# Altium project NASCO Alarm Interface.PrjPcb
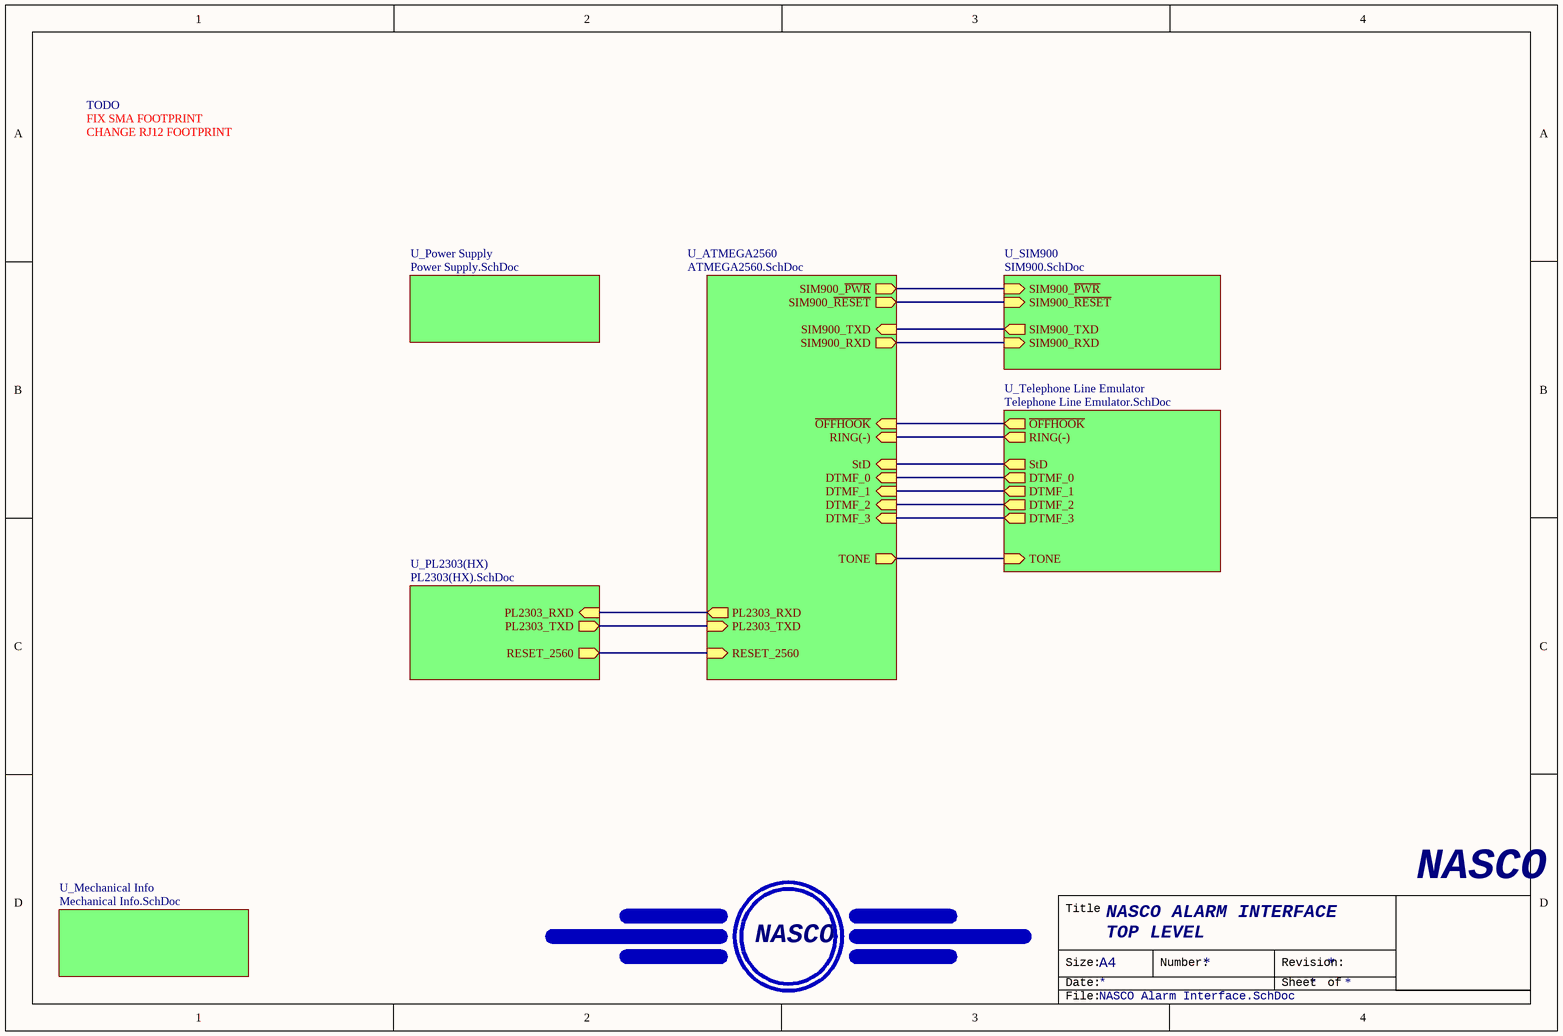
[diagram p0: NASCO Alarm Interface.SchDoc]
7 sheets, 123 parts. Net scope: hierarchical (ports join the sheet entries above them; power ports are global).
Board files: Seeed Case (113x70x25) - Alarm Interface End PLate 01.PcbDoc, Seeed Case (113x70x25) - Alarm Interface (2560).PcbDoc, Seeed Case (113x70x25) - Alarm Interface End PLate 02.PcbDoc, SEEED ORDER ALARM INTERFACE 100mm x 150mm.PcbDoc
Sheets:
  NASCO Alarm Interface.SchDoc
    U_Power Supply = Power Supply.SchDoc
    U_SIM900 = SIM900.SchDoc
    U_Mechanical Info = Mechanical Info.SchDoc
    U_Telephone Line Emulator = Telephone Line Emulator.SchDoc
    U_PL2303(HX) = PL2303(HX).SchDoc
    U_ATMEGA2560 = ATMEGA2560.SchDoc

## Sheet NASCO Alarm Interface.SchDoc: NASCO ALARM INTERFACE
size A4; Title2: TOP LEVEL

### Parts
(Parts that share a designator on the sheet are numbered #1, #2 ... from top to bottom, then left to right.)
?#1  (no value)  (no BOM)
LOGO1  NASCO  [NASCO_LOGO]  (value not drawn)  (no BOM)

### Sub-sheets
U_ATMEGA2560 = ATMEGA2560.SchDoc: DTMF_1 (in), ~{OFFHOOK} (in), DTMF_2 (in), DTMF_0 (in), SIM900_~{RESET} (out), SIM900_~{PWR} (out), TONE (out), SIM900_TXD (in), SIM900_RXD (out), StD (in), DTMF_3 (in), PL2303_RXD (out), PL2303_TXD (in), RESET_2560 (in), RING(-) (in)
U_Mechanical Info = Mechanical Info.SchDoc: no entries
U_PL2303(HX) = PL2303(HX).SchDoc: PL2303_TXD (out), PL2303_RXD (in), RESET_2560 (out)
U_Power Supply = Power Supply.SchDoc: no entries
U_SIM900 = SIM900.SchDoc: SIM900_~{PWR} (in), SIM900_~{RESET} (in), SIM900_RXD (in), SIM900_TXD (out)
U_Telephone Line Emulator = Telephone Line Emulator.SchDoc: ~{OFFHOOK} (out), StD (out), DTMF_0 (out), DTMF_1 (out), DTMF_2 (out), DTMF_3 (out), TONE (in), RING(-) (out)

### Nets
DTMF_0: sheet U_Telephone Line Emulator/DTMF_0, sheet U_ATMEGA2560/DTMF_0
DTMF_1: sheet U_Telephone Line Emulator/DTMF_1, sheet U_ATMEGA2560/DTMF_1
DTMF_2: sheet U_Telephone Line Emulator/DTMF_2, sheet U_ATMEGA2560/DTMF_2
DTMF_3: sheet U_Telephone Line Emulator/DTMF_3, sheet U_ATMEGA2560/DTMF_3
PL2303_RXD: sheet U_PL2303(HX)/PL2303_RXD, sheet U_ATMEGA2560/PL2303_RXD
PL2303_TXD: sheet U_PL2303(HX)/PL2303_TXD, sheet U_ATMEGA2560/PL2303_TXD
RING(-): sheet U_Telephone Line Emulator/RING(-), sheet U_ATMEGA2560/RING(-)
SIM900_~{PWR}: sheet U_SIM900/SIM900_~{PWR}, sheet U_ATMEGA2560/SIM900_~{PWR}
SIM900_~{RESET}: sheet U_SIM900/SIM900_~{RESET}, sheet U_ATMEGA2560/SIM900_~{RESET}
SIM900_RXD: sheet U_SIM900/SIM900_RXD, sheet U_ATMEGA2560/SIM900_RXD
SIM900_TXD: sheet U_SIM900/SIM900_TXD, sheet U_ATMEGA2560/SIM900_TXD
StD: sheet U_Telephone Line Emulator/StD, sheet U_ATMEGA2560/StD
TONE: sheet U_Telephone Line Emulator/TONE, sheet U_ATMEGA2560/TONE
NetC28_1: sheet U_PL2303(HX)/RESET_2560, sheet U_ATMEGA2560/RESET_2560
(unnamed): sheet U_Telephone Line Emulator/~{OFFHOOK}, sheet U_ATMEGA2560/~{OFFHOOK}

### Notes on the sheet
- TODO
- FIX SMA FOOTPRINT
- CHANGE RJ12 FOOTPRINT
- Title
- NASCO
- Size:
- Date:
- A4
- Number:
- Revision:
- Sheet
- of
- File:

### Library data of the parts
?#1 = NASCO_LOGO: LOGO
LOGO1 = NASCO_LOGO: Quad 2-Input OR Gate

## Sheet Power Supply.SchDoc: Power Supply
size A4; Title2: NASCO ALARM INTERFACE
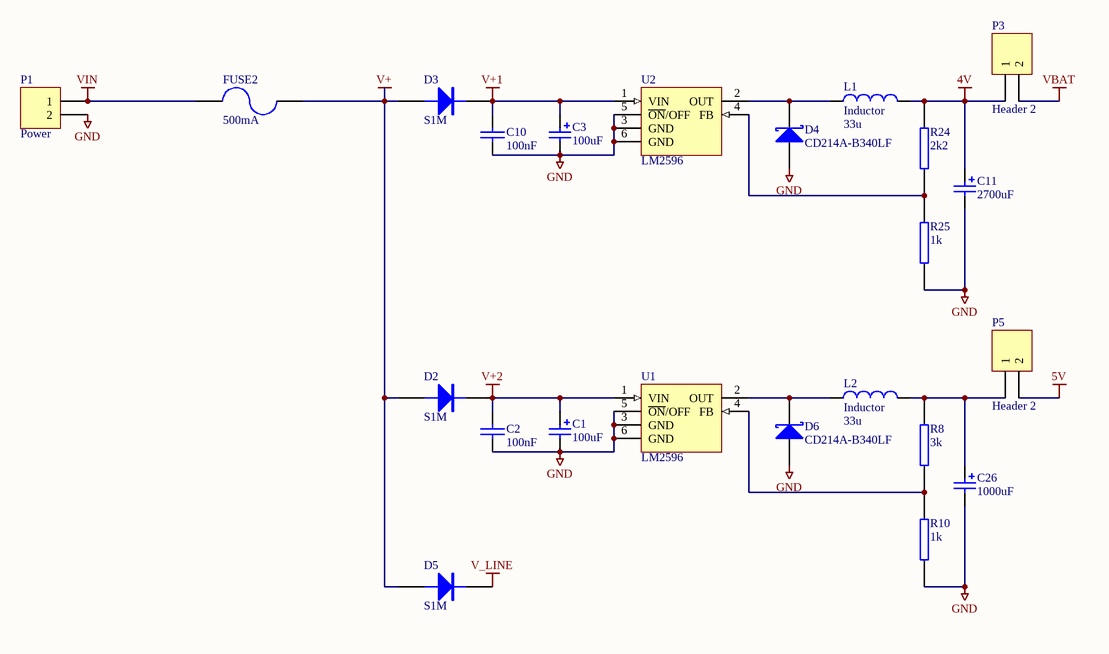
[diagram p1: Power Supply.SchDoc]

### Parts
(Parts that share a designator on the sheet are numbered #1, #2 ... from top to bottom, then left to right.)
?#2  (no value)  (no BOM)
C1  100uF  [CAP ELECTRO SIZE-E]
C2  100nF  [CAP (3D) - 0603]
C3  100uF  [CAP ELECTRO SIZE-E]
C10  100nF  [CAP (3D) - 0603]
C11  2700uF  [CAP D(16) L(20) P(7.5)]
C26  1000uF  [CAP ELECTRO SIZE-G]
D2  S1M  [DO-214AC]
D3  S1M  [DO-214AC]
D4  CD214A-B340LF  [DO-214AC]
D5  S1M  [DO-214AC]
D6  CD214A-B340LF  [DO-214AC]
FUSE2  500mA  [miniSMD Polyswitch]
L1  Inductor  value 33u  [INDUCTOR 12x12x8]
L2  Inductor  value 33u  [INDUCTOR 12x12x8]
P1  Power  [5.08mm HEADER 2 Way RA- With Socket]
P3  Header 2  [HDR1X2]
P5  Header 2  [HDR1X2]
R8  3k  [RES (3D) - 0603]
R10  1k  [RES (3D) - 0603]
R24  2k2  [RES (3D) - 0603]
R25  1k  [RES (3D) - 0603]
U1  LM2596  [D2-PAK]
U2  LM2596  [D2-PAK]

### Nets
4V: C11.1 L1.2 P3.1 R24.2
5V: P5.2
GND: C1.2 C2.2 C3.2 C10.2 C11.2 C26.2 D4.1(A) D6.1(A) P1.2 R10.1 R25.1 U1.3(GND) U1.5(~{ON}/OFF) U1.6(GND) U2.3(GND) U2.5(~{ON}/OFF) U2.6(GND)
V+: D2.1(A) D3.1(A) D5.1(A) FUSE2.2
V+1: C3.1 C10.1 D3.2(K) U2.1(VIN)
V+2: C1.1 C2.1 D2.2(K) U1.1(VIN)
V_LINE: D5.2(K)
VBAT: P3.2
VIN: FUSE2.1 P1.1
NetC26_1: C26.1 L2.2 P5.1 R8.2
NetD4_2: D4.2(K) L1.1 U2.2(OUT)
NetD6_2: D6.2(K) L2.1 U1.2(OUT)
NetR8_1: R8.1 R10.2 U1.4(FB)
NetR24_1: R24.1 R25.2 U2.4(FB)

### Notes on the sheet
- Title
- NASCO
- Size:
- Date:
- A4
- Number:
- Revision:
- Sheet
- of
- File:

### Library data of the parts
?#2 = NASCO_LOGO: LOGO
C1 C3 = 100uF 25V ALU E: 100uF 25V; Manufacturer: Cornell Dubilier; Manufacturer Part No.: AVE107M25E16T-F; Mouser Part no.: 598-AVE107M25E16T-F; Web link: http://au.mouser.com/ProductDetail/Cornell-Dubilier/AVE107M25E16T-F/?qs=%2fha2pyFaduhQkIFxhTUYGHjqKtvzDu12YwE1LyhVKKrxkq5U81i5PA%3d%3d; value: 100uF
C2 C10 = CAP: CAPACITOR SMD 0603; Manufacturer: Murata; Manufacturer Part No.: GRM155R61C104KA88D; value: 100nF; Mouser Part no.: 81-GRM155R61C104KA8D; Web link: http://au.mouser.com/ProductDetail/Murata/GRM155R61C104KA88D/?qs=sGAEpiMZZMvQvaS66kI3TkNFPW5pBWErgqKrdkfeYZ0%3d
C11 = 1000uF 10V ALU G_1: 1000uF 10V; Manufacturer: United Chemi-Con; Manufacturer Part No.: EKY160ELL272ML2; Mouser Part no.: 661-EKY160ELL272ML2; Web link: http://au.mouser.com/ProductDetail/United-Chemi-Con/EKY-160ELL272ML20S/?qs=sGAEpiMZZMvwFf0viD3Y3bQZ8h8ImlHo9v7yx13%2fr4k%3d; value: 2700uF
C26 = 1000uF 10V ALU G_1: 1000uF 10V; Manufacturer: Cornell Dubilier; Manufacturer Part No.: AVE108M10G24T-F; Mouser Part no.: 598-AVE108M10G24T-F; Web link: http://au.mouser.com/ProductDetail/Cornell-Dubilier/AVE108M10G24T-F/?qs=%2fha2pyFadug75LpTQjHjNGQwsAAww7cyi%2fKrS3OU0d%252beOC8957EMoA%3d%3d; value: 1000uF
D2 D3 D5 = DIODE: DIODE, POWER; Manufacturer: TAIWAN SEMI; Mouser Part no.: 821-S1M; Manufacturer Part No.: S1M; value: S1M; Web link: http://au.mouser.com/ProductDetail/Taiwan-Semiconductor/S1M/?qs=sGAEpiMZZMtEwUVCuofpuOlSmRjzJonf%252bmrIm0%252bGbjE%3d
D4 D6 = CD214A-B340LF: CD214A-B340LF 3A SCHOTTKY (40V RB); Manufacturer: Bourns; Value: CD214A-B340LF; Mouser Part No.: 652-CD214A-B340L; Manufacturer Part No.: CD214A-B340LF; Web link: http://au.mouser.com/ProductDetail/Bourns/CD214A-B340LF/?qs=sGAEpiMZZMtQ8nqTKtFS%2fKwbXeWFhcmVvJlIIUC0L%252bY%3d
FUSE2 = POLYSWITCH 500mA: Manufacturer: Tyco Electronics / Raychem; Manufacturer Part No.: MINISMDC050F-2; Mouser Part no.: 650-MINISMDC050F-2; Web link: http://au.mouser.com/ProductDetail/Tyco-Electronics-Raychem/MINISMDC050F-2/?qs=sGAEpiMZZMu7EFbsM1w0neRfX3mrvYIvOpkrchiUGng%3d
L1 L2 = Inductor: Manufacturer: Wurth Electronics; Manufacturer Part No.: 744771133; Mouser Part no.: 710-744771133; Web link: http://au.mouser.com/ProductDetail/Wurth-Electronics/744771133/?qs=sGAEpiMZZMsg%252by3WlYCkU2ZZAkgqljbFFwrzfiyMF9Y%3d
P1 = Header 2H: Header, 2-Pin, Right Angle; Manufacturer: Phoenix Contact; Manufacturer Part No.: 1759017; value: 1759017; Mouser Part no.: 651-1759017; Web link: http://au.mouser.com/ProductDetail/Phoenix-Contact/1759017/?qs=%2fha2pyFaduimeVQ2k4UhN6tA4bHm0b5wnhHOccU1U80%3d
P3 P5 = Header 2: Header, 2-Pin; value: 0.100" HEADER
R8 R24 = RES SMD 0603 10k: RESISTOR SMD 0603; Manufacturer: Panasonic; Manufacturer Part No.: ERJ-3GEYJ302V; Mouser Part no.: 667-ERJ-3GEYJ302V; Web link: http://au.mouser.com/ProductDetail/Panasonic/ERJ-3GEYJ302V/?qs=sGAEpiMZZMtlubZbdhIBINbsJb0hdM3zru2opQIvmPo%3d
  R8: value: 3k
  R24: value: 2k2
R10 R25 = RES SMD 0603 10k: RESISTOR SMD 0603; Manufacturer: Bourns; Manufacturer Part No.: CR0603-JW-102ELF; Mouser Part no.: 652-CR0603-JW-102ELF; Web link: http://au.mouser.com/ProductDetail/Bourns/CR0603-JW-102ELF/?qs=sGAEpiMZZMu61qfTUdNhG2nPoCjtvs%252bRXTOJv8O9Kbk%3d; value: 1k
U1 U2 = LM2576D2T-ADJ: Easy Switcher 3.0A Step-Down Voltage Regulator; Manufacturer: ON Semiconductor; Manufacturer Part No.: LM2596DSADJR4G; Mouser Part no.: 863-LM2596DSADJR4G; Web link: http://au.mouser.com/ProductDetail/ON-Semiconductor/LM2596DSADJR4G/?qs=sGAEpiMZZMtitjHzVIkrqajYz32%2fGPtlajdv3bHlruk%3d; value: LM2596

## Sheet SIM900.SchDoc: SIM900
size A4; Title2: NASCO ALARM INTERFACE
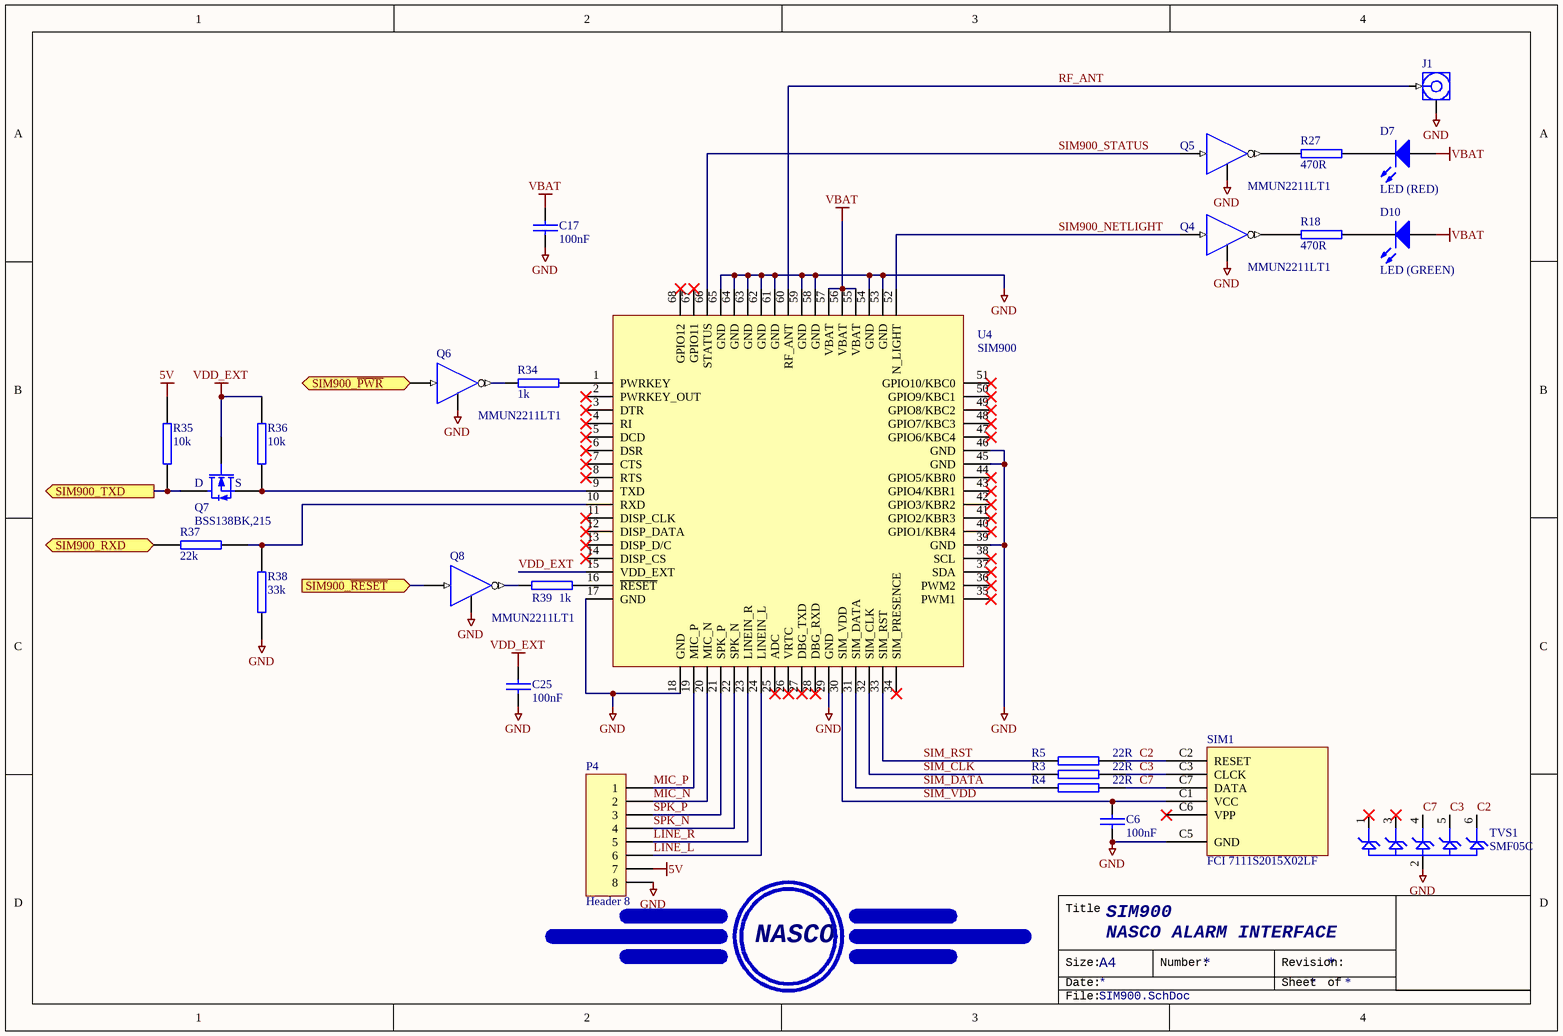
[diagram p2: SIM900.SchDoc]

### Parts
(Parts that share a designator on the sheet are numbered #1, #2 ... from top to bottom, then left to right.)
?#3  (no value)  (no BOM)
C6  100nF  [CAP (3D) - 0603]
C17  100nF  [CAP (3D) - 0603]
C25  100nF  [CAP (3D) - 0603]
D7  LED (RED)  [LED(3D) 3MM RIGHT ANGLE RED]
D10  LED (GREEN)  [LED(3D) 3MM RIGHT ANGLE GREEN]
J1  SMA  [SMA EDGE MOUNT]  (value not drawn)
P4  Header 8  [HDR1X8 (3D)]  (no BOM)
Q4  MMUN2211LT1  [SOT23-3L]
Q5  MMUN2211LT1  [SOT23-3L]
Q6  MMUN2211LT1  [SOT23-3L]
Q7  BSS138BK,215  [SOT23-3L]
Q8  MMUN2211LT1  [SOT23-3L]
R3  22R  [RES (3D) - 0603]
R4  22R  [RES (3D) - 0603]
R5  22R  [RES (3D) - 0603]
R18  470R  [RES (3D) - 0603]
R27  470R  [RES (3D) - 0603]
R34  1k  [RES (3D) - 0603]
R35  10k  [RES (3D) - 0603]
R36  10k  [RES (3D) - 0603]
R37  22k  [RES (3D) - 0603]
R38  33k  [RES (3D) - 0603]
R39  1k  [RES (3D) - 0603]
SIM1  FCI 7111S2015X02LF  [SIM CARD]
TVS1  SMF05C  [SOT-363]
U4  SIM900  [SIM900]

### Ports
SIM900_RXD (in), SIM900_TXD (out), SIM900_~{PWR} (in), SIM900_~{RESET} (in)

### Nets
5V: P4.7 R35.2
GND: C6.2 C17.2 C25.2 J1.2(GND) P4.8 Q4.2(E) Q5.2(E) Q6.2(E) Q8.2(E) R38.2 SIM1.C5(GND) TVS1.2(A) U4.17(GND) U4.18(GND) U4.29(GND) U4.39(GND) U4.45(GND) U4.46(GND) U4.53(GND) U4.54(GND) U4.58(GND) U4.59(GND) U4.61(GND) U4.62(GND) U4.63(GND) U4.64(GND) U4.65(GND)
VBAT: C17.1 D7.1(A) D10.1(A) U4.55(VBAT) U4.56(VBAT) U4.57(VBAT)
VDD_EXT: C25.1 Q7.1(G) R36.2 U4.15(VDD_EXT)
C2: R5.2 SIM1.C2(RESET) TVS1.6(K5)
C3: R3.2 SIM1.C3(CLCK) TVS1.5(K4)
C7: R4.2 SIM1.C7(DATA) TVS1.4(K3)
LINE_L: P4.6 U4.24(LINEIN_L)
LINE_R: P4.5 U4.23(LINEIN_R)
MIC_N: P4.2 U4.20(MIC_N)
MIC_P: P4.1 U4.19(MIC_P)
RF_ANT: J1.1(Signal) U4.60(RF_ANT)
SIM900_NETLIGHT: Q4.1(B) U4.52(N_LIGHT)
SIM900_~{PWR}: Q6.1(B) ; port SIM900_~{PWR}
SIM900_~{RESET}: Q8.1(B) ; port SIM900_~{RESET}
SIM900_RXD: R37.1 ; port SIM900_RXD
SIM900_STATUS: Q5.1(B) U4.66(STATUS)
SIM900_TXD: Q7.3(D) R35.1 ; port SIM900_TXD
SIM_CLK: R3.1 U4.32(SIM_CLK)
SIM_DATA: R4.1 U4.31(SIM_DATA)
SIM_RST: R5.1 U4.33(SIM_RST)
SIM_VDD: C6.1 SIM1.C1(VCC) U4.30(SIM_VDD)
SPK_N: P4.4 U4.22(SPK_N)
SPK_P: P4.3 U4.21(SPK_P)
NetD7_2: D7.2(K) R27.2
NetD10_2: D10.2(K) R18.2
NetQ4_3: Q4.3(C) R18.1
NetQ5_3: Q5.3(C) R27.1
NetQ6_3: Q6.3(C) R34.1
NetQ7_2: Q7.2(S) R36.1 U4.9(TXD)
NetQ8_3: Q8.3(C) R39.1
NetR34_2: R34.2 U4.1(PWRKEY)
NetR37_2: R37.2 R38.1 U4.10(RXD)
NetR39_2: R39.2 U4.16(~{RESET})

Not connected (* = marked no-connect by the designer): SIM1 C6(VPP)*; TVS1 1(K1)* 3(K2)*; U4 2(PWRKEY_OUT)* 3(DTR)* 4(RI)* 5(DCD)* 6(DSR)* 7(CTS)* 8(RTS)* 11(DISP_CLK)* 12(DISP_DATA)* 13(DISP_D/C)* 14(DISP_CS)* 25(ADC)* 26(VRTC)* 27(DBG_TXD)* 28(DBG_RXD)* 34(SIM_PRESENCE)* 35(PWM1)* 36(PWM2)* 37(SDA)* 38(SCL)* 40(GPIO1/KBR4)* 41(GPIO2/KBR3)* 42(GPIO3/KBR2)* 43(GPIO4/KBR1)* 44(GPIO5/KBR0)* 47(GPIO6/KBC4)* 48(GPIO7/KBC3)* 49(GPIO8/KBC2)* 50(GPIO9/KBC1)* 51(GPIO10/KBC0)* 67(GPIO11)* 68(GPIO12)*

### Notes on the sheet
- Title
- NASCO
- Size:
- Date:
- A4
- Number:
- Revision:
- Sheet
- of
- File:

### Library data of the parts
?#3 = NASCO_LOGO: LOGO
C6 = CAP SMD 0603 100nF: CAPACITOR SMD 0603; Manufacturer: Murata; Manufacturer Part No.: GCM188R71C104KA37D; Mouser Part no.: 81-GCM188R71C104KA7D; Web link: http://au.mouser.com/ProductDetail/Murata/GCM188R71C104KA37D/?qs=aEuGZpxfbxWKAxwYn%252beTMg%3d%3d; value: 100nF
C17 = CAP: as C2 on sheet Power Supply; value: 100nF; Mouser Part no.: 81-GRM155R61C104KA8D; Web link: http://au.mouser.com/ProductDetail/Murata/GRM155R61C104KA88D/?qs=sGAEpiMZZMvQvaS66kI3TkNFPW5pBWErgqKrdkfeYZ0%3d
C25 = CAP SMD 0603 1nF: CAPACITOR SMD 0603; Manufacturer: Murata; Manufacturer Part No.: GCM1885C1H102JA16D; Mouser Part no.: 81-GCM1885C1H102JA6D; Web link: http://au.mouser.com/ProductDetail/Murata/GCM1885C1H102JA16D/?qs=aEuGZpxfbxWracuMmQWyxw%3d%3d; value: 100nF
D7 = LED 3mm RED: 3mm RED LED; Manufacturer: Lite-On; Manufacturer Part No.: LTL-4261NR; value: RED 3mm; Mouser Part no.: 859-LTL-4261NR; Web link: http://au.mouser.com/ProductDetail/Lite-On/LTL-307E/?qs=sGAEpiMZZMs4quMj8r4lmhnQMFVtnV3yedxNjWAKgTA%3d
D10 = LED 3mm GREEN: 3mm GREEN LED; Manufacturer: Lite-On; Manufacturer Part No.: LTL-1CHG; value: GREEN 3mm; Mouser Part no.: 859-LTL-1CHG; Web link: http://au.mouser.com/ProductDetail/Lite-On/LTL-1CHG/?qs=sGAEpiMZZMs4quMj8r4lmsfF1SjbyuBqGk7sQVhKrYk%3d
J1 = SMA 142-0701-801: JOHNSON / EMERSON SMA PCB EDGE; Manufacturer: Johnson / Emerson; Manufacturer Part No.: 142-0701-801; Mouser Part no.: 530-142-0701-801; value: SMA; Web link: http://au.mouser.com/ProductDetail/Emerson-Connectivity-Solutions/142-0701-801/?qs=%2fha2pyFadui1v%252bStuw7JbRg0ffTvIaD43efyyE%252b%252b43dWi%252bwW6373fw%3d%3d
P4 = Header 8: Header, 8-Pin; value: 0.100" HEADER
Q4-Q6 Q8 = MMUN221LT1 NPN DIGITAL TRANSISTOR: Manufacturer: ON Semiconductor; Manufacturer Part No.: MMUN2211LT1G; value: NPN; Mouser Part no.: 863-MMUN2211LT1G; Web link: http://au.mouser.com/ProductDetail/ON-Semiconductor/MMUN2211LT1G/?qs=sGAEpiMZZMt32xmUYxteeYvHZcSNQKJZCO%252bIh%252bS%252bXZs%3d
Q7 = BSS138BK,215 SOT23: N-Channel MOSFET; Manufacturer: NXP Semiconductors; Value: BSS138BK,215; Manufacturer Part No.: BSS138BK,215; Mouser Part no.: 771-BSS138BK215; Web link: http://au.mouser.com/ProductDetail/NXP/BSS138BK215/?qs=%2fha2pyFaduhOCsXH6DamaYx2vFX9CGnGyFNFIdZCCfo2MZSmQFQsKQ%3d%3d
R3-R5 = RES SMD 0603 0R: RESISTOR SMD 0603 0R; Manufacturer: Xicon; Manufacturer Part No.: 301-22-RC; Mouser Part no.: 301-22-RC; Web link: http://au.mouser.com/ProductDetail/Xicon/301-22-RC/?qs=sGAEpiMZZMu61qfTUdNhG77xSY1jRpIyXwGVN4E99m8%3d; value: 22R
R18 R27 = RES SMD 0603 590R: RESISTOR SMD 0603 590R; Manufacturer: Vishay; Manufacturer Part No.: CRCW0603470RJNEA; Mouser Part no.: 71-CRCW0603J-470-E3; Web link: http://au.mouser.com/ProductDetail/Vishay-Dale/CRCW0603470RJNEA/?qs=sGAEpiMZZMtlubZbdhIBIDQnfxtYKdcjBa1CNCbPnm4%3d; value: 470R
R34 R39 = RES SMD 0603 1k: RESISTOR SMD 0603 1k; Manufacturer: Bourns; Manufacturer Part No.: CR0603-JW-102ELF; Mouser Part no.: 652-CR0603-JW-102ELF; Web link: http://au.mouser.com/ProductDetail/Bourns/CR0603-JW-102ELF/?qs=sGAEpiMZZMu61qfTUdNhG2nPoCjtvs%252bRXTOJv8O9Kbk%3d; value: 1k
R35 R36 = RES SMD 0603 10k: RESISTOR SMD 0603 10k; Manufacturer: Bourns; Manufacturer Part No.: CR0603FX-1002ELF; Mouser Part no.: 652-CR0603FX-1002ELF; Web link: http://au.mouser.com/Search/Refine.aspx?Keyword=652-CR0603FX-1002ELF; value: 10k
R37 = RES SMD 0603 1k: RESISTOR SMD 0603 1k; Manufacturer: Bourns; Manufacturer Part No.: CR0603-FX-4223ELF; Mouser Part no.: 652-CR0603FX-4223ELF; Web link: http://au.mouser.com/ProductDetail/Bourns/CR0603-FX-4223ELF/?qs=CCIlxZRRv7hqply3rAXy4hrq0%2fcMGkZy; value: 22k
R38 = RES SMD 0603 1k: RESISTOR SMD 0603 1k; Manufacturer: Vishay; Manufacturer Part No.: CRCW06033K30JNEB; Mouser Part no.: 71-CRCW06033K30JNEB; Web link: http://au.mouser.com/ProductDetail/Vishay-Dale/CRCW06033K30JNEB/?qs=sGAEpiMZZMtlubZbdhIBIGFBittgiF6Fxuh7evu4ctk%3d; value: 33k
SIM1 = FCI 7111S2015X02LF: FCI 7111S2015X02LF SIM CARD HOLDER; value: SIM1; Manufacturer: FCI; Manufacturer Part No.: 7111S2015X02LF; Mouser Part no.: 649-7111S2015X02LF; Web link: http://au.mouser.com/ProductDetail/FCI/7111S2015X02LF/?qs=%2fha2pyFaduj7uBU2gxQ%2fq23qVE2ewQPoOGeAxVKmqgNANLOlyef2cg%3d%3d
TVS1 = SMF05C: Manufacturer: ON Semiconductor; Manufacturer Part No.: SMF05CT1G; value: SMF05CT1G; Mouser Part no.: 863-SMF05CT1G; Web link: http://au.mouser.com/ProductDetail/ON-Semiconductor/SMF05CT1G/?qs=sGAEpiMZZMv50VCOoJQfutYYatoVJ2WkCxvFJNVrxzU%3d
U4 = SIM900: Manufacturer: SIMCOM; Manufacturer Part No.: SIM900; value: SIM900; Web link: http://www.aliexpress.com/store/product/SIMCOM-SIM900-module/404544_689100740.html

## Sheet Mechanical Info.SchDoc: Mechanical Information
size A4; Title2: NASCO ALARM INTERFACE
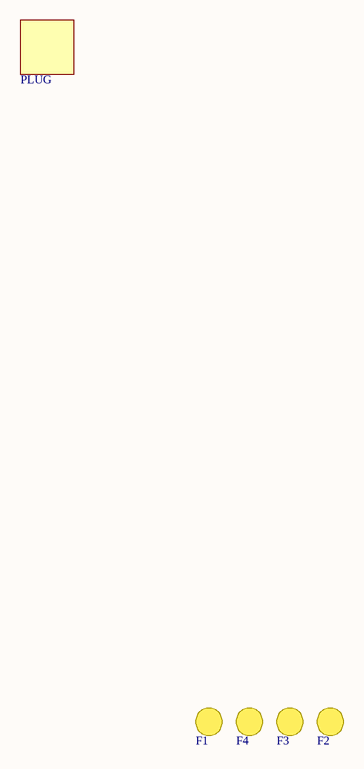
[diagram p3: Mechanical Info.SchDoc]

### Parts
(Parts that share a designator on the sheet are numbered #1, #2 ... from top to bottom, then left to right.)
?#4  (no value)  (no BOM)
F1  Fiducial  [Fiducial]  (value not drawn)  (no BOM)
F2  Fiducial  [Fiducial]  (value not drawn)  (no BOM)
F3  Fiducial  [Fiducial]  (value not drawn)  (no BOM)
F4  Fiducial  [Fiducial]  (value not drawn)  (no BOM)
PLUG  PLUG  (value not drawn)

### Notes on the sheet
- Title
- NASCO
- Size:
- Date:
- A4
- Number:
- Revision:
- Sheet
- of
- File:

### Library data of the parts
?#4 = NASCO_LOGO: LOGO
F1-F4 = Fiducial: Manufacturer: N/A - PCB ARTWORK; Manufacturer Part No.: N/A
PLUG = PLUG: Manufacturer: Phoenix Contact; Manufacturer Part No.: 1757019; value: 1757019; Mouser Part no.: 651-1757019; Web link: http://au.mouser.com/ProductDetail/Phoenix-Contact/1757019/?qs=sGAEpiMZZMvlX3nhDDO4AGmxTE5dWGQY3FmaBdjJUN0%3d

## Sheet Telephone Line Emulator.SchDoc: Telephone Line Emulator
size A4; Title2: NASCO ALARM INTERFACE
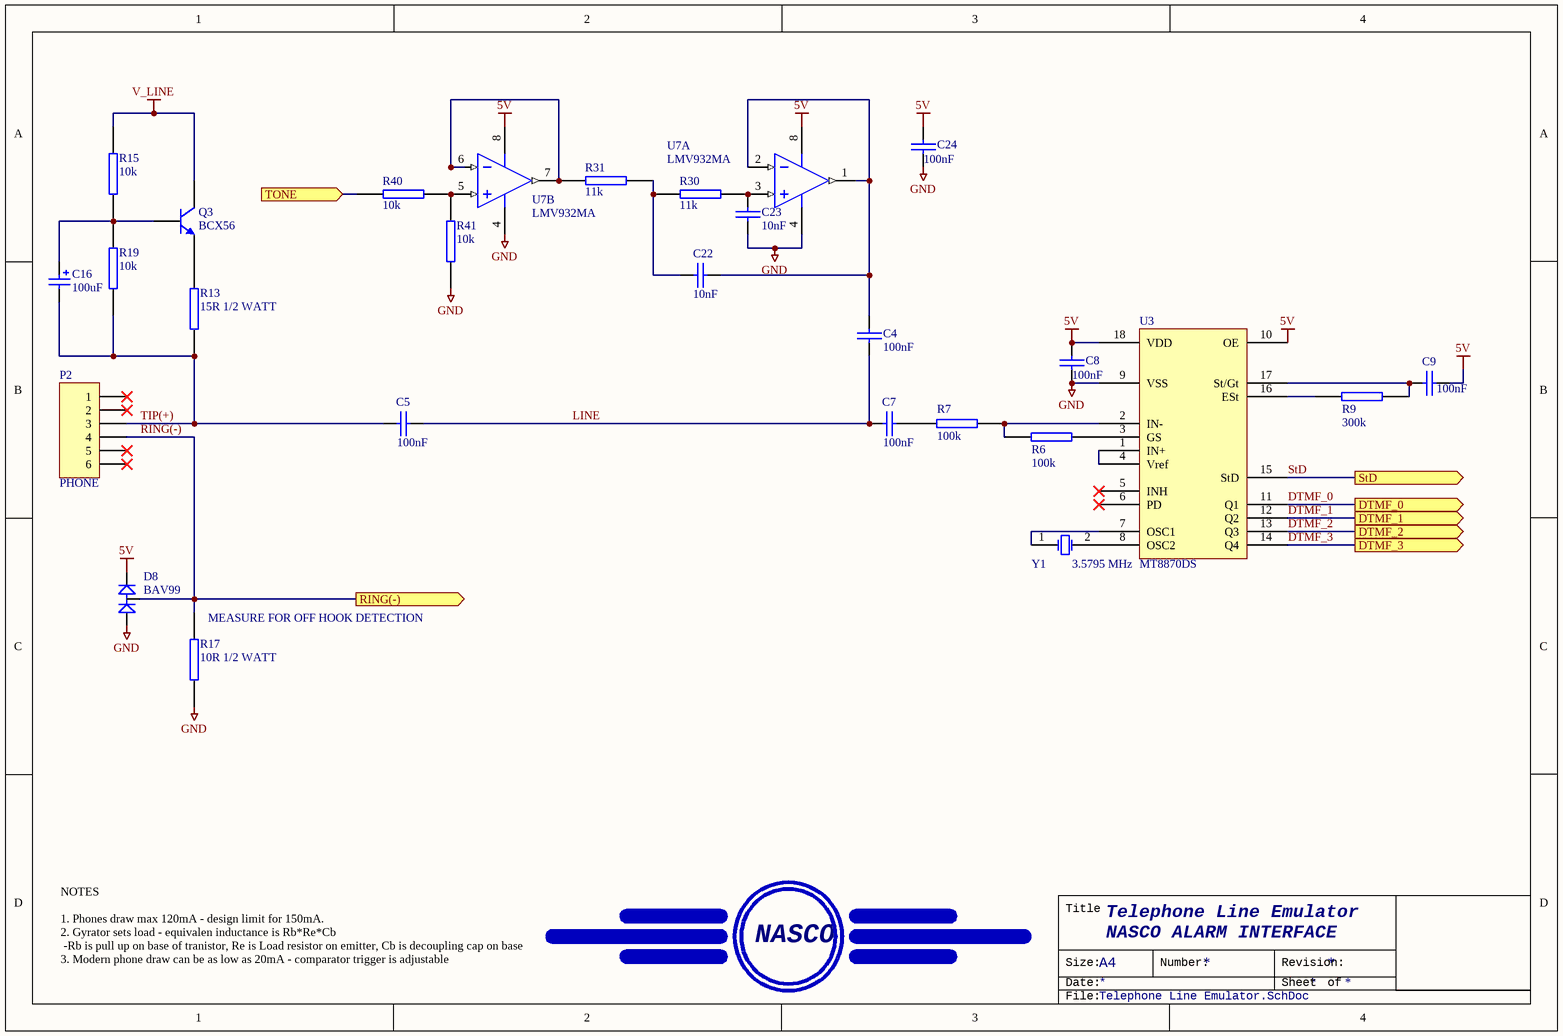
[diagram p4: Telephone Line Emulator.SchDoc]

### Parts
(Parts that share a designator on the sheet are numbered #1, #2 ... from top to bottom, then left to right.)
?#5  (no value)  (no BOM)
C4  100nF  [CAP (3D) - 0603]
C5  100nF  [CAP (3D) - 0603]
C7  100nF  [CAP (3D) - 0603]
C8  100nF  [CAP (3D) - 0603]
C9  100nF  [CAP (3D) - 0603]
C16  100uF  [CAP ELECTRO SIZE-E]
C22  10nF  [CAP (3D) - 0603]
C23  10nF  [CAP (3D) - 0603]
C24  100nF  [CAP (3D) - 0603]
D8  BAV99  [SOT23-3L]
P2  PHONE  [MOLEXZ RJ11]
Q3  BCX56  [SOT89]
R6  100k  [RES (3D) - 0603]
R7  100k  [RES (3D) - 0603]
R9  300k  [RES (3D) - 0603]
R13  15R 1/2 WATT  [RES (3D) - 1210]
R15  10k  [RES (3D) - 0603]
R17  10R 1/2 WATT  [RES (3D) - 1210]
R19  10k  [RES (3D) - 0603]
R30  11k  [RES (3D) - 0603]
R31  11k  [RES (3D) - 0603]
R40  10k  [RES (3D) - 0603]
R41  10k  [RES (3D) - 0603]
U3  MT8870DS  [SOIC-18]
U7  LMV932MA  [SO-8]  (parts A,B of 2)
Y1  3.5795 MHz  [HC49/4H_SMX]

### Ports
DTMF_0 (out), DTMF_1 (out), DTMF_2 (out), DTMF_3 (out), RING(-) (out), StD (out), TONE (in)

### Nets
5V: C8.1 C9.1 C24.1 D8.2(C2) U3.10(OE) U3.18(VDD) U7.8(V+)
GND: C8.2 C23.2 C24.2 D8.1(A1) R17.1 R41.1 U3.9(VSS) U7.4(GND)
V_LINE: Q3.2(C) R15.2
DTMF_0: U3.11(Q1) ; port DTMF_0
DTMF_1: U3.12(Q2) ; port DTMF_1
DTMF_2: U3.13(Q3) ; port DTMF_2
DTMF_3: U3.14(Q4) ; port DTMF_3
LINE: C4.2 C5.1 C7.2
RING(-): D8.3(C1/A2) P2.4 R17.2 ; port RING(-)
StD: U3.15(StD) ; port StD
TIP(+): C5.2 C16.2 P2.3 R13.1 R19.1
TONE: R40.1 ; port TONE
NetC4_1: C4.1 C22.2 U7.1(OUTA) U7.2(INA-)
NetC7_1: C7.1 R7.1
NetC9_2: C9.2 R9.2 U3.17(St/Gt)
NetC16_1: C16.1 Q3.3(B) R15.1 R19.2
NetC22_1: C22.1 R30.1 R31.2
NetC23_1: C23.1 R30.2 U7.3(INA+)
NetQ3_1: Q3.1(E) R13.2
NetR6_1: R6.1 R7.2 U3.2(IN-)
NetR6_2: R6.2 U3.3(GS)
NetR9_1: R9.1 U3.16(ESt)
NetR31_1: R31.1 U7.6(INB-) U7.7(OUTB)
NetR40_2: R40.2 R41.2 U7.5(INB+)
NetU3_1: U3.1(IN+) U3.4(Vref)
NetU3_7: U3.7(OSC1) Y1.1(OSC1)
NetU3_8: U3.8(OSC2) Y1.2(OSC2)

Not connected (* = marked no-connect by the designer): P2 1* 2* 5* 6*; U3 5(INH)* 6(PD)*

### Notes on the sheet
- (near R17) MEASURE FOR OFF HOOK DETECTION
- NOTES
  1. Phones draw max 120mA - design limit for 150mA.
  2. Gyrator sets load - equivalen inductance is Rb*Re*Cb
  -Rb is pull up on base of tranistor, Re is Load resistor on emitter, Cb is decoupling cap on base
  3. Modern phone draw can be as low as 20mA - comparator trigger is adjustable
- Title
- NASCO
- Size:
- Date:
- A4
- Number:
- Revision:
- Sheet
- of
- File:

### Library data of the parts
?#5 = NASCO_LOGO: LOGO
C4 C5 C7-C9 C24 = CAP: CAPACITOR SMD 0402; Manufacturer: Murata; Manufacturer Part No.: GCM188R71C104KA37D; Value: 100nF; Mouser Part no.: 81-GCM188R71C104KA7D; Web link: http://au.mouser.com/ProductDetail/Murata/GCM188R71C104KA37D/?qs=aEuGZpxfbxWKAxwYn%252beTMg%3d%3d
C16 = 100uF 25V ALU E: as C1 on sheet Power Supply; Mouser Part no.: 598-AVE107M25E16T-F; Web link: http://au.mouser.com/ProductDetail/Cornell-Dubilier/AVE107M25E16T-F/?qs=%2fha2pyFaduhQkIFxhTUYGHjqKtvzDu12YwE1LyhVKKrxkq5U81i5PA%3d%3d; value: 100uF
C22 C23 = CAP SMD 0603 100nF: CAPACITOR SMD 0603; Manufacturer: Murata; Manufacturer Part No.: GCM188R71H103KA37D; value: 10nF; Mouser Part no.: 81-GCM188R71H103KA7D; Web link: http://au.mouser.com/ProductDetail/Murata/GCM188R71H103KA37D/?qs=sGAEpiMZZMvQvaS66kI3TsYN5z8BU0lue524z4jMLFo%3d
D8 = BAV99: DUAL DIODE, BAV99; Manufacturer: FAIRCHILD SEMICONDUCTOR; Mouser Part no.: 771-BAV99/T3; Manufacturer Part No.: BAV99; value: BAV99; Web link: http://au.mouser.com/ProductDetail/NXP-Semiconductors/BAV99-T3/?qs=sGAEpiMZZMtldOIVIVqa3WNg7zlWz8nBhXHsMX6ttIg%3d
P2 = Header 6: Header, 6-Pin; Manufacturer: Molex; Manufacturer Part No.: 43860-0020; Value: RJ12; Mouser Part No.: 538-43860-0020; Web link: http://au.mouser.com/ProductDetail/Molex/43860-0020/?qs=%2fha2pyFaduiNL6xQ0Kh7Hr7w3depcjdzE6sQfTKDcgo%3d
Q3 = BCX56: NPN Bipolar Transistor; Manufacturer: NXP Semiconductors; Manufacturer Part No.: BCX56-16,135; Mouser Part no.: 771-BCX56-16135; value: BCX56; Web link: http://au.mouser.com/ProductDetail/NXP-Semiconductors/BCX56-16135/?qs=sGAEpiMZZMshyDBzk1%2fWi7dklbCN21lX%252bMOhYZE9xSQ%3d
R6 R7 = RES SMD 0603 100R: RESISTOR SMD 0603; Manufacturer: Bourns; Manufacturer Part No.: CR0603-FX-1003HLF; Value: 100k; Mouser Part no.: 652-CR0603-FX1003HLF; Web link: http://au.mouser.com/ProductDetail/Bourns/CR0603-FX-1003HLF/?qs=sGAEpiMZZMtlubZbdhIBIJoX7P5Bll7agPmSg7minrk%3d
R9 = RES SMD 0603 100R: RESISTOR SMD 0603; Manufacturer: Panasonic; Manufacturer Part No.: ERJ-3EKF3003V; Value: 300k; Mouser Part no.: 667-ERJ-3EKF3003V; Web link: http://au.mouser.com/ProductDetail/Panasonic-Electronic-Components/ERJ-3EKF3003V/?qs=sGAEpiMZZMtlubZbdhIBILWcrV%252bWBYJCTyl7GE3YiME%3d
R13 = RES SMD 0603 100R: RESISTOR SMD 0603; Manufacturer: Panasonic; Manufacturer Part No.: ERJ-14NF15R0U; Value: 15R 1/2 WATT; Mouser Part No.: 667-ERJ-14NF15R0U; Web link: http://au.mouser.com/ProductDetail/Panasonic/ERJ-14NF15R0U/?qs=%2fha2pyFaduiRtFL%252bUIaHLpkEnPFulQf6Pw3ymSu1pa3%2fVAYEq2%252bQvg%3d%3d
R15 R19 = RES SMD 0603 10k: as R35 on sheet SIM900; Mouser Part no.: 652-CR0603FX-1002ELF; Web link: http://au.mouser.com/Search/Refine.aspx?Keyword=652-CR0603FX-1002ELF; value: 10k
R17 = RES SMD 0603 100R: RESISTOR SMD 0603; Manufacturer: Panasonic; Manufacturer Part No.: ERJ-14NF10R0U; Value: 10R 1/2 WATT; Mouser Part No.: 667-ERJ-14NF10R0U; Web link: http://au.mouser.com/ProductDetail/Panasonic/ERJ-14NF10R0U/?qs=%2fha2pyFaduiRtFL%252bUIaHLhq8AVNX5DKnOm6ct2rZgdY1OTBP5rrjxg%3d%3d
R30 R31 = RES SMD 0603 1k: RESISTOR SMD 0603 1k; Manufacturer: Bourns; Manufacturer Part No.: CR0603FX-1102ELF; Mouser Part no.: 652-CR0603FX-1102ELF; Web link: http://au.mouser.com/ProductDetail/Bourns/CR0603-FX-1102ELF/?qs=sGAEpiMZZMtlubZbdhIBIJoX7P5Bll7awqQ9N9RUQg0%3d; value: 11k
R40 R41 = RES SMD 0603 1k: RESISTOR SMD 0603 1k; Manufacturer: Bourns; Manufacturer Part No.: CR0603FX-1002ELF; Mouser Part no.: 652-CR0603FX-1002ELF; Web link: http://au.mouser.com/Search/Refine.aspx?Keyword=652-CR0603FX-1002ELF; value: 10k
U3 = MT8870: MT8870 DTMF DECODER; Manufacturer: Zarlink; Value: MT8870DS; Web link: http://www.futurlec.com.au/price1.jsp?part_no=MT8870DS
U7 = LMV932MA/NOPB: Low Power Dual Operational Amplifier, 8-pin Narrow SOIC; Manufacturer: Texas Instruments; Value: LMV932MA; Manufacturer Part No.: LMV932MA/NOPB; Mouser Part no.: 926-LMV932MA/NOPB; Web link: http://au.mouser.com/ProductDetail/Texas-Instruments/LMV932MA-NOPB/?qs=sGAEpiMZZMtCHixnSjNA6M%252bbBaCn4IWbXgUPZoZBrA4%3d
Y1 = XTAL: Crystal Oscillator; Manufacturer: ECS; Manufacturer Part No.: ECS-35-17-5PX-TR; Mouser Part No.: 520-CSM357-17-X; Value: 3.5795 MHz; Web link: http://au.mouser.com/ProductDetail/ECS/ECS-35-17-5PX-TR/?qs=sGAEpiMZZMukHu%252bjC5l7YSPb5QW3X1l0%2fsW5L67T75c%3d

## Sheet PL2303(HX).SchDoc
size A4
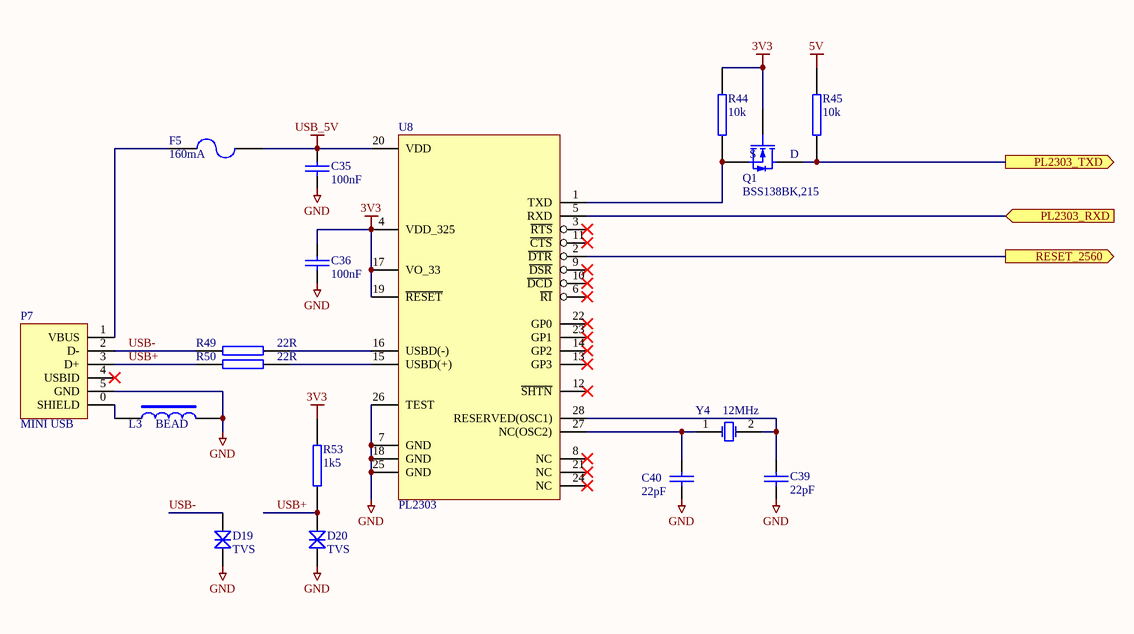
[diagram p5: PL2303(HX).SchDoc]

### Parts
C35  100nF  [CAP (3D) - 0603]
C36  100nF  [CAP (3D) - 0603]
C39  22pF  [CAP (3D) - 0603]
C40  22pF  [CAP (3D) - 0603]
D19  TVS  [TVS (3D) - 0603]
D20  TVS  [TVS (3D) - 0603]
F5  160mA  [1206]
L3  BEAD  [RES (3D) - 1210]
P7  MINI USB  [MINI USB]
Q1  BSS138BK,215  [SOT23-3L]
R44  10k  [RES (3D) - 0603]
R45  10k  [RES (3D) - 0603]
R49  22R  [RES (3D) - 0603]
R50  22R  [RES (3D) - 0603]
R53  1k5  [RES (3D) - 0603]
U8  PL2303  [SSOP28]
Y4  12MHz  [HC49/4H_SMX]

### Ports
PL2303_RXD (in), PL2303_TXD (out), RESET_2560 (out)

### Nets
3V3: C36.1 Q1.1(G) R44.2 R53.1 U8.4(VDD_325) U8.17(VO_33) U8.19(~{RESET})
5V: R45.2
GND: C35.2 C36.2 C39.2 C40.2 D19.1(A) D20.1(A) L3.2 P7.5(GND) U8.7(GND) U8.18(GND) U8.25(GND) U8.26(TEST)
USB_5V: C35.1 F5.2 U8.20(VDD)
PL2303_RXD: U8.5(RXD) ; port PL2303_RXD
PL2303_TXD: Q1.3(D) R45.1 ; port PL2303_TXD
USB+: D20.2(K) P7.3(D+) R50.1 R53.2
USB-: D19.2(K) P7.2(D-) R49.1
NetC28_1: U8.2(~{DTR}) ; port RESET_2560
NetC39_1: C39.1 U8.28(RESERVED(OSC1)) Y4.2(OSC2)
NetC40_1: C40.1 U8.27(NC(OSC2)) Y4.1(OSC1)
NetF5_1: F5.1 P7.1(VBUS)
NetL3_1: L3.1 P7.0(SHIELD)
NetQ1_2: Q1.2(S) R44.1 U8.1(TXD)
NetR49_2: R49.2 U8.16(USBD(-))
NetR50_2: R50.2 U8.15(USBD(+))

Not connected (* = marked no-connect by the designer): P7 4(USBID)*; U8 3(~{RTS})* 6(~{RI})* 8(NC)* 9(~{DSR})* 10(~{DCD})* 11(~{CTS})* 12(~{SHTN})* 13(GP3)* 14(GP2)* 21(NC)* 22(GP0)* 23(GP1)* 24(NC)*

### Library data of the parts
C35 C36 = CAP SMD 0603 100nF: as C6 on sheet SIM900; Mouser Part no.: 81-GCM188R71C104KA7D; Web link: http://au.mouser.com/ProductDetail/Murata/GCM188R71C104KA37D/?qs=aEuGZpxfbxWKAxwYn%252beTMg%3d%3d; value: 100nF
C39 C40 = CAP SMD 0603 1nF: CAPACITOR SMD 0603; Manufacturer: Vishay; Manufacturer Part No.: VJ0603A220JXACW1BC; value: 22pF; Mouser Part no.: 77-VJ0603A220JXACBC; Web link: http://au.mouser.com/ProductDetail/Vishay-Vitramon/VJ0603A220JXACW1BC/?qs=sGAEpiMZZMv9Q1JI0Mo%2ftTD%2f4380kv7n
D19 D20 = TVS DIODE: Transient Voltage Suppression (TVS) Diode; Manufacturer Part No.: CG0603MLC-05E; Manufacturer: Bourns; Value: TVS; Mouser Part no.: 652-CG0603MLC-05E; Web link: http://au.mouser.com/ProductDetail/Bourns/CG0603MLC-05E/?qs=%2fha2pyFaduj8GWc5RpRwWsoz%252bsBNDfM0b%2fMwO0m8cAS%252b28tb9AwLWQ%3d%3d
F5 = Fuse 2: Fuse; Manufacturer: Littlefuse; Manufacturer Part No.: 1206L016WR; Revision: July-2002: Re-released for DXP Platform.; Mouser Part No.: 576-1206L016WR; Value: 160mA; Web link: http://au.mouser.com/ProductDetail/Littelfuse/1206L016WR/?qs=PWhpLWeW8weybSDHdny44Q%3d%3d
L3 = INDUCTOR SMD 1210 100uH: INDUCTOR SMD 1210; Manufacturer: Fair-Rite; Manufacturer Part No.: 2512063007Y3; Mouser Part no.: 636-2512063007Y3; Web link: http://au.mouser.com/ProductDetail/Fair-Rite/2512063007Y3/?qs=%2fha2pyFadugMqBZ0p6tBCteJ%252bl1Ngi4ZSrBdKx9yVdYrQlmO7YKqKA%3d%3d; Value: BEAD
P7 = MICRO USB: Manufacturer: Keystone Electronics; Manufacturer Part No.: 534-934; value: USB-MICRO; Mouser Part no.: 934; Web link: http://au.mouser.com/ProductDetail/Keystone-Electronics/934/?qs=sGAEpiMZZMulM8LPOQ%252byk%2fSsgKophuqxMvSf7TGGJTc%3d
Q1 = BSS138BK,215 SOT23: as Q7 on sheet SIM900; Value: BSS138BK,215; Manufacturer Part No.: BSS138BK,215; Mouser Part no.: 771-BSS138BK215; Web link: http://au.mouser.com/ProductDetail/NXP/BSS138BK215/?qs=%2fha2pyFaduhOCsXH6DamaYx2vFX9CGnGyFNFIdZCCfo2MZSmQFQsKQ%3d%3d
R44 R45 = RES SMD 0603 10k: as R35 on sheet SIM900; Mouser Part no.: 652-CR0603FX-1002ELF; Web link: http://au.mouser.com/Search/Refine.aspx?Keyword=652-CR0603FX-1002ELF; value: 10k
R49 R50 = RES SMD 0603 0R: as R3 on sheet SIM900; value: 22R; Mouser Part no.: 301-22-RC; Web link: http://au.mouser.com/ProductDetail/Xicon/301-22-RC/?qs=sGAEpiMZZMu61qfTUdNhG77xSY1jRpIyXwGVN4E99m8%3d
R53 = RES SMD 0603 0R: RESISTOR SMD 0603 0R; value: 1k5
U8 = PL2303: PL2303 USB to 232 Converter (FT232 Compatible); Manufacturer: PROLIFIC; Manufacturer Part No.: PL2303TA
Y4 = XTAL: Crystal Oscillator; Manufacturer: ECS; Value: 12MHz

## Sheet ATMEGA2560.SchDoc
size A4
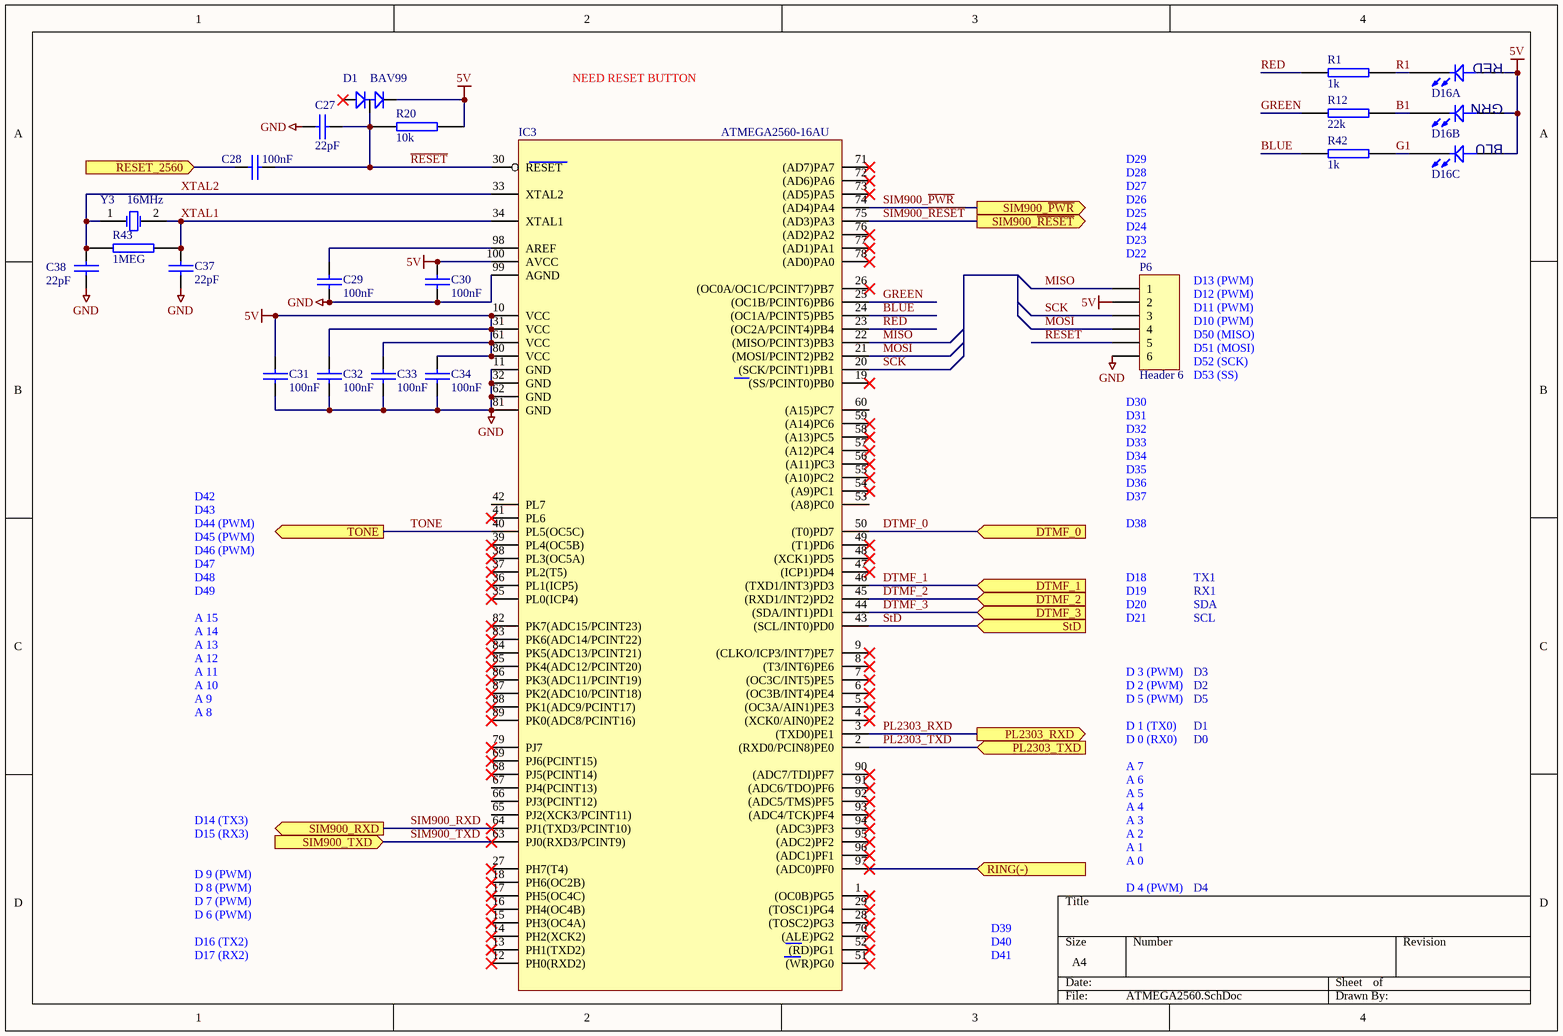
[diagram p6: ATMEGA2560.SchDoc]

### Parts
C27  22pF  [CAP (3D) - 0603]
C28  100nF  [CAP (3D) - 0603]
C29  100nF  [CAP (3D) - 0603]
C30  100nF  [CAP (3D) - 0603]
C31  100nF  [CAP (3D) - 0603]
C32  100nF  [CAP (3D) - 0603]
C33  100nF  [CAP (3D) - 0603]
C34  100nF  [CAP (3D) - 0603]
C37  22pF  [CAP (3D) - 0603]
C38  22pF  [CAP (3D) - 0603]
D1  BAV99  [SOT23-3L]
D16  RGB 5mm  [LED(3D) 5MM RIGHT ANGLE (RGB) - COMMON ANODE]  (value not drawn)  (parts A,B,C of 3)
IC3  ATMEGA2560-16AU  [TQFP100]
P6  Header 6  [HDR2X3 (3D)]  (no BOM)
R1  1k  [RES (3D) - 0603]
R12  22k  [RES (3D) - 0603]
R20  10k  [RES (3D) - 0603]
R42  1k  [RES (3D) - 0603]
R43  1MEG  [RES (3D) - 0603]
Y3  16MHz  [HC49/4H_SMX]

### Ports
DTMF_0 (in), DTMF_1 (in), DTMF_2 (in), DTMF_3 (in), PL2303_RXD (out), PL2303_TXD (in), RESET_2560 (in), RING(-) (in), SIM900_RXD (out), SIM900_TXD (in), SIM900_~{PWR} (out), SIM900_~{RESET} (out), StD (in), TONE (out)

### Nets
5V: C30.1 C31.1 C32.1 C33.1 C34.1 D1.2(C2) D16.2(A) IC3.10(VCC) IC3.31(VCC) IC3.61(VCC) IC3.80(VCC) IC3.100(AVCC) P6.2 R20.2
GND: C27.1 C29.2 C30.2 C31.2 C32.2 C33.2 C34.2 C37.2 C38.2 IC3.11(GND) IC3.32(GND) IC3.62(GND) IC3.81(GND) IC3.99(AGND) P6.6
B1: D16.4(K) R12.2
BLUE: IC3.24((OC1A/PCINT5)PB5) R42.1
DTMF_0: IC3.50((T0)PD7) ; port DTMF_0
DTMF_1: IC3.46((TXD1/INT3)PD3) ; port DTMF_1
DTMF_2: IC3.45((RXD1/INT2)PD2) ; port DTMF_2
DTMF_3: IC3.44((SDA/INT1)PD1) ; port DTMF_3
G1: D16.3(K) R42.2
GREEN: IC3.25((OC1B/PCINT6)PB6) R12.1
MISO: IC3.22((MISO/PCINT3)PB3) P6.1
MOSI: IC3.21((MOSI/PCINT2)PB2) P6.4
PL2303_RXD: IC3.3((TXD0)PE1) ; port PL2303_RXD
PL2303_TXD: IC3.2((RXD0/PCIN8)PE0) ; port PL2303_TXD
R1: D16.1(K) R1.2
~{RESET}: C27.2 C28.2 D1.3(C1/A2) IC3.30(RESET) P6.5 R20.1
RED: IC3.23((OC2A/PCINT4)PB4) R1.1
RING(-): IC3.97((ADC0)PF0) ; port RING(-)
SCK: IC3.20((SCK/PCINT1)PB1) P6.3
SIM900_~{PWR}: IC3.74((AD4)PA4) ; port SIM900_~{PWR}
SIM900_~{RESET}: IC3.75((AD3)PA3) ; port SIM900_~{RESET}
SIM900_RXD: IC3.64(PJ1(TXD3/PCINT10)) ; port SIM900_RXD
SIM900_TXD: IC3.63(PJ0(RXD3/PCINT9)) ; port SIM900_TXD
StD: IC3.43((SCL/INT0)PD0) ; port StD
TONE: IC3.40(PL5(OC5C)) ; port TONE
XTAL1: C37.1 IC3.34(XTAL1) R43.2 Y3.2(OSC2)
XTAL2: C38.1 IC3.33(XTAL2) R43.1 Y3.1(OSC1)
NetC28_1: C28.1 ; port RESET_2560
NetC29_1: C29.1 IC3.98(AREF)

Not connected (* = marked no-connect by the designer): D1 1(A1)*; IC3 1((OC0B)PG5)* 4((XCK0/AIN0)PE2)* 5((OC3A/AIN1)PE3)* 6((OC3B/INT4)PE4)* 7((OC3C/INT5)PE5)* 8((T3/INT6)PE6)* 9((CLKO/ICP3/INT7)PE7)* 12(PH0(RXD2))* 13(PH1(TXD2))* 14(PH2(XCK2))* 15(PH3(OC4A))* 16(PH4(OC4B))* 17(PH5(OC4C))* 18(PH6(OC2B))* 19((SS/PCINT0)PB0)* 26((OC0A/OC1C/PCINT7)PB7)* 27(PH7(T4))* 28((TOSC2)PG3)* 29((TOSC1)PG4)* 35(PL0(ICP4))* 36(PL1(ICP5))* 37(PL2(T5))* 38(PL3(OC5A))* 39(PL4(OC5B))* 41(PL6)* 42(PL7) 47((ICP1)PD4)* 48((XCK1)PD5)* 49((T1)PD6)* 51((WR)PG0)* 52((RD)PG1)* 53((A8)PC0) 54((A9)PC1)* 55((A10)PC2)* 56((A11)PC3)* 57((A12)PC4)* 58((A13)PC5)* 59((A14)PC6)* 60((A15)PC7) 65(PJ2(XCK3/PCINT11)) 66(PJ3(PCINT12)) 67(PJ4(PCINT13)) 68(PJ5(PCINT14))* 69(PJ6(PCINT15))* 70((ALE)PG2)* 71((AD7)PA7)* 72((AD6)PA6)* 73((AD5)PA5)* 76((AD2)PA2)* 77((AD1)PA1)* 78((AD0)PA0)* 79(PJ7)* 82(PK7(ADC15/PCINT23))* 83(PK6(ADC14/PCINT22))* 84(PK5(ADC13/PCINT21))* 85(PK4(ADC12/PCINT20))* 86(PK3(ADC11/PCINT19))* 87(PK2(ADC10/PCINT18))* 88(PK1(ADC9/PCINT17))* 89(PK0(ADC8/PCINT16))* 90((ADC7/TDI)PF7)* 91((ADC6/TDO)PF6)* 92((ADC5/TMS)PF5)* 93((ADC4/TCK)PF4)* 94((ADC3)PF3)* 95((ADC2)PF2)* 96((ADC1)PF1)*

### Notes on the sheet
- NEED RESET BUTTON
- D29
- D28
- (near P6) D23
- D24
- D25
- D26
- D27
- (near P6) D22
- D11 (PWM)
- D12 (PWM)
- D13 (PWM)
- D53 (SS)
- D52 (SCK)
- D51 (MOSI)
- D50 (MISO)
- D10 (PWM)
- (near P6) D30
- D31
- D32
- D33
- D42
- D43
- D37
- D36
- D35
- D34
- D47
- D48
- D44 (PWM)
- D45 (PWM)
- D46 (PWM)
- D18
- D38
- TX1
- D49
- A 13
- A 14
- A 15
- D19
- D20
- D21
- RX1
- SDA
- SCL
- A 8
- A 9
- A 10
- A 11
- A 12
- D 5 (PWM)
- D 2 (PWM)
- D 3 (PWM)
- D5
- D3
- D2
- D 0 (RX0)
- D 1 (TX0)
- A 6
- A 7
- D0
- D1
- D15 (RX3)
- D14 (TX3)
- A 1
- A 2
- A 3
- A 4
- A 5
- D 6 (PWM)
- D 7 (PWM)
- D 8 (PWM)
- D 9 (PWM)
- D 4 (PWM)
- A 0
- D4
- D17 (RX2)
- D16 (TX2)
- D41
- D40
- D39
- (in symbol RGB_5mm, part A) RED
- (in symbol RGB_5mm, part B) GRN
- (in symbol RGB_5mm, part C) BLU

### Library data of the parts
C27-C34 = CAP SMD 0603 100nF: as C6 on sheet SIM900; Mouser Part no.: 81-GCM188R71C104KA7D; Web link: http://au.mouser.com/ProductDetail/Murata/GCM188R71C104KA37D/?qs=aEuGZpxfbxWKAxwYn%252beTMg%3d%3d
  C27: value: 22pF
  C28-C34: value: 100nF
C37 C38 = CAP SMD 0603 1nF: as C39 on sheet PL2303(HX); value: 22pF; Mouser Part no.: 77-VJ0603A220JXACBC; Web link: http://au.mouser.com/ProductDetail/Vishay-Vitramon/VJ0603A220JXACW1BC/?qs=sGAEpiMZZMv9Q1JI0Mo%2ftTD%2f4380kv7n
D1 = BAV99: as D8 on sheet Telephone Line Emulator; Mouser Part no.: 771-BAV99/T3; Manufacturer Part No.: BAV99; value: BAV99; Web link: http://au.mouser.com/ProductDetail/NXP-Semiconductors/BAV99-T3/?qs=sGAEpiMZZMtldOIVIVqa3WNg7zlWz8nBhXHsMX6ttIg%3d
D16 = RGB_5mm: Manufacturer: ANY - COMMON ANODE; Manufacturer Part No.: ANY - COMMON ANODE; value: RGB 5mm; Web link: eBay
IC3 = ATMEGA25602560-16AU: Manufacturer: Atmel; Manufacturer Part No.: ATmega2560-16AU; Mouser Part no.: 556-ATMEGA2560-16AU; value: ATmega2560-16AU; Web link: http://au.mouser.com/ProductDetail/Atmel/ATmega2560-16AU/?qs=sGAEpiMZZMvqv2n3s2xjsVIKSdqlAUq67FxyjUE6IyE%3d
P6 = Header 6: Header, 6-Pin; value: 0.100" HEADER
R1 R42 = RES SMD 0603 10k: as R10 on sheet Power Supply; Mouser Part no.: 652-CR0603-JW-102ELF; Web link: http://au.mouser.com/ProductDetail/Bourns/CR0603-JW-102ELF/?qs=sGAEpiMZZMu61qfTUdNhG2nPoCjtvs%252bRXTOJv8O9Kbk%3d; value: 1k
R12 = RES SMD 0603 10k: RESISTOR SMD 0603; Manufacturer: Bourns; Manufacturer Part No.: CR0603-FX-4223ELF; Mouser Part no.: 652-CR0603FX-4223ELF; Web link: http://au.mouser.com/ProductDetail/Bourns/CR0603-FX-4223ELF/?qs=CCIlxZRRv7hqply3rAXy4hrq0%2fcMGkZy; value: 22k
R20 = RES SMD 0603 10k: as R35 on sheet SIM900; Mouser Part no.: 652-CR0603FX-1002ELF; Web link: http://au.mouser.com/Search/Refine.aspx?Keyword=652-CR0603FX-1002ELF; value: 10k
R43 = RES SMD 0603 0R: RESISTOR SMD 0603 0R; Manufacturer: Bourns; Manufacturer Part No.: CR0603-FX-1004ELF; Value: 1MEG; Mouser Part no.: 652-CR0603FX-1004ELF; Web link: http://au.mouser.com/ProductDetail/Bourns/CR0603-FX-1004ELF/?qs=sGAEpiMZZMu61qfTUdNhG6LqqFhkr6pUwbJgorvoIQA%3d
Y3 = XTAL: Crystal Oscillator; Manufacturer: ECS; Manufacturer Part No.: ECS-160-20-5PX-TR; Mouser Part No.: 520-CSM1600-20-X; Value: 16MHz; Web link: http://au.mouser.com/ProductDetail/ECS/ECS-160-20-5PX-TR/?qs=sGAEpiMZZMsBj6bBr9Q9aQ6SZfIlWoiS4s1%252bSpYOVXo%3d

## Nets that join several sheets
5V: Power Supply (P5.2), SIM900 (P4.7 R35.2), Telephone Line Emulator (7 pins), PL2303(HX) (R45.2), ATMEGA2560 (14 pins)
GND: Power Supply (17 pins), SIM900 (27 pins), Telephone Line Emulator (8 pins), PL2303(HX) (12 pins), ATMEGA2560 (15 pins)
V_LINE: Power Supply (D5.2), Telephone Line Emulator (Q3.2 R15.2)
VBAT: Power Supply (P3.2), SIM900 (6 pins)
DTMF_0: Telephone Line Emulator (U3.11), ATMEGA2560 (IC3.50)
DTMF_1: Telephone Line Emulator (U3.12), ATMEGA2560 (IC3.46)
DTMF_2: Telephone Line Emulator (U3.13), ATMEGA2560 (IC3.45)
DTMF_3: Telephone Line Emulator (U3.14), ATMEGA2560 (IC3.44)
NetC28_1: PL2303(HX) (U8.2), ATMEGA2560 (C28.1)
PL2303_RXD: PL2303(HX) (U8.5), ATMEGA2560 (IC3.3)
PL2303_TXD: PL2303(HX) (Q1.3 R45.1), ATMEGA2560 (IC3.2)
RING(-): Telephone Line Emulator (D8.3 P2.4 R17.2), ATMEGA2560 (IC3.97)
SIM900_~{PWR}: SIM900 (Q6.1), ATMEGA2560 (IC3.74)
SIM900_~{RESET}: SIM900 (Q8.1), ATMEGA2560 (IC3.75)
SIM900_RXD: SIM900 (R37.1), ATMEGA2560 (IC3.64)
SIM900_TXD: SIM900 (Q7.3 R35.1), ATMEGA2560 (IC3.63)
StD: Telephone Line Emulator (U3.15), ATMEGA2560 (IC3.43)
TONE: Telephone Line Emulator (R40.1), ATMEGA2560 (IC3.40)